# Altium schematic sheet HW1_Witt_u1090350.SchDoc
size A; SheetNumber: 1; SheetTotal: 1
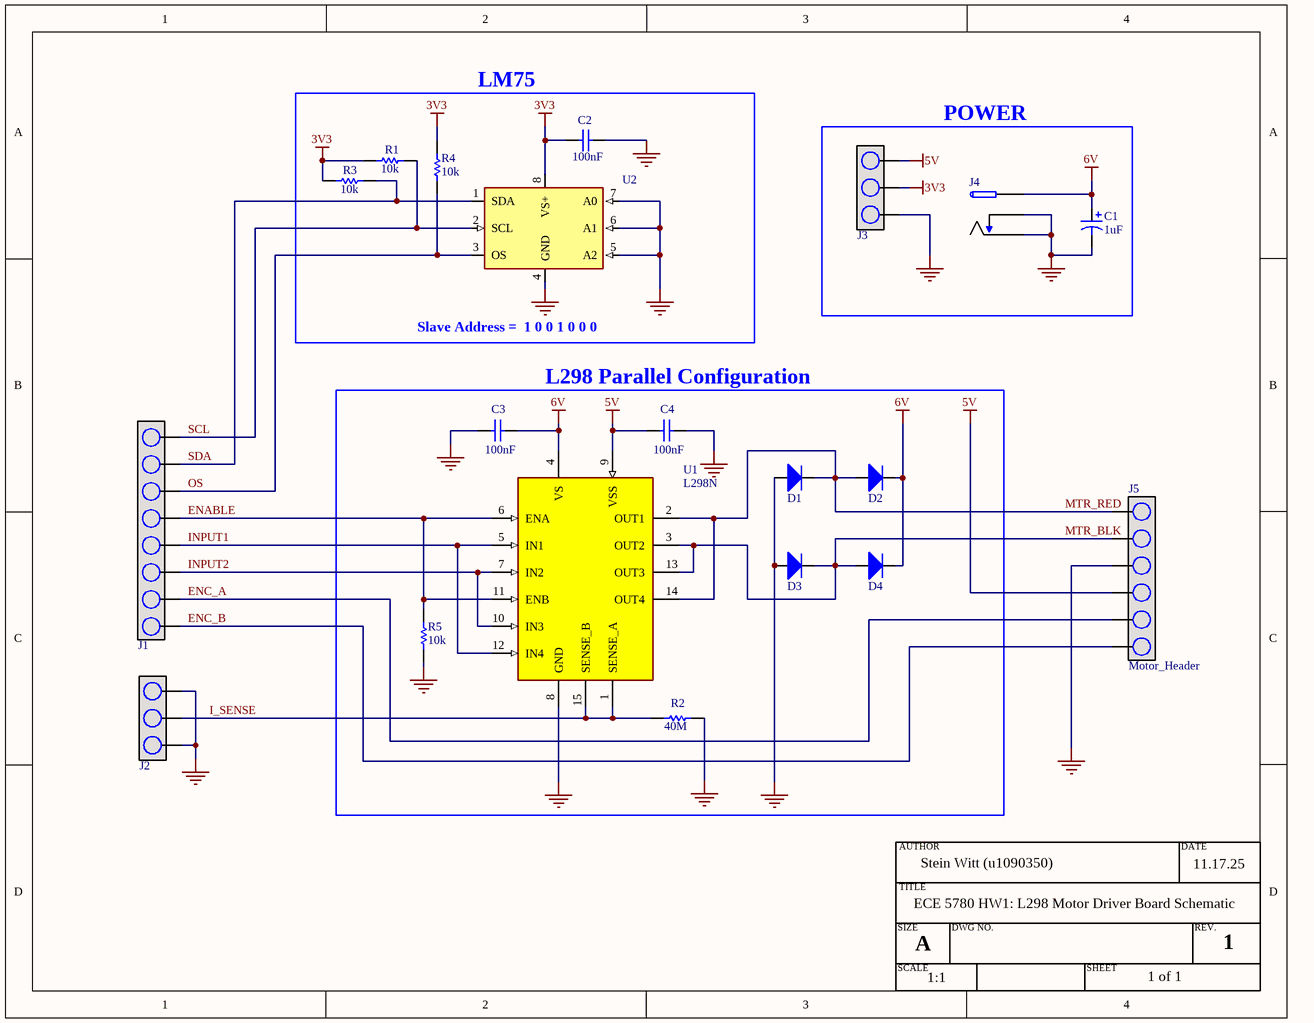
[diagram p0: HW1_Witt_u1090350.SchDoc]

## Parts
*  Title Block  (value not drawn)  (graphical)
C1  value 1uF  [CAP_TH_Radial_0511]  (hidden comment: REA010M2CBK-0511P)
C2  Capacitance: 100nF  [CAP_1206]  (hidden comment: C1206C104K5RAC7800)
C3  Capacitance: 100nF  [CAP_1206]  (hidden comment: C1206C104K5RAC7800)
C4  Capacitance: 100nF  [CAP_1206]  (hidden comment: C1206C104K5RAC7800)
D1  RS2AA R3G  [RS2AA]  (value not drawn)
D2  RS2AA R3G  [RS2AA]  (value not drawn)
D3  RS2AA R3G  [RS2AA]  (value not drawn)
D4  RS2AA R3G  [RS2AA]  (value not drawn)
J1  8 Pin Male Connector  [8 Pin THT Header]  (value not drawn)
J2  3 Pin 2.54mm Male Connector  [3 Pin THT Header]  (value not drawn)
J3  3 Pin 2.54mm Male Connector  [3 Pin THT Header]  (value not drawn)
J4  Barrel Jack  [GRAVITECH_CON-SOCJ-2155]  (value not drawn)
J5  Motor_Header  [6 Pin THT Header]
R1  value 10k  [RES_1206]  (hidden comment: RC1206JR-0710KL)
R2  value 40M  [RES_1206]  (hidden comment: RL1206FR-070R04L)
R3  value 10k  [RES_1206]  (hidden comment: RC1206JR-0710KL)
R4  value 10k  [RES_1206]  (hidden comment: RC1206JR-0710KL)
R5  value 10k  [RES_1206]  (hidden comment: RC1206JR-0710KL)
U1  L298N  [L298N]
U2  LM75AIMXNOPB  [SOIC8]  (value not drawn)

## Blocks framed on the sheet
LM75: C2 R1 R3 R4 U2
POWER: C1 J3 J4
L298 Parallel Configuration: C3 C4 D1-D4 R2 R5 U1

## Nets
3V3: C2.2 J3.2 R1.1 R3.1 R4.2 U2.8(VS+)
5V: C4.1 J3.3 J5.4 U1.9(VSS)
6V: C1.2(+) C3.2 D2.1(K) D4.1(K) J4.1(POS) U1.4(VS)
GND: C1.1(-) C2.1 C3.1 C4.2 D1.2(A) D3.2(A) J2.1 J2.3 J3.1 J4.2(NEG) J4.3(SW) J5.3 R2.1 R5.1 U1.8(GND) U2.4(GND) U2.5(A2) U2.6(A1) U2.7(A0)
ENABLE: J1.5 R5.2 U1.6(ENA) U1.11(ENB)
ENC_A: J1.2 J5.5
ENC_B: J1.1 J5.6
I_SENSE: J2.2 R2.2 U1.1(SENSE_A) U1.15(SENSE_B)
INPUT1: J1.4 U1.5(IN1) U1.12(IN4)
INPUT2: J1.3 U1.7(IN2) U1.10(IN3)
MTR_BLK: D3.1(K) D4.2(A) J5.2 U1.3(OUT2) U1.13(OUT3)
MTR_RED: D1.1(K) D2.2(A) J5.1 U1.2(OUT1) U1.14(OUT4)
OS: J1.6 R4.1 U2.3(OS)
SCL: J1.8 R1.2 U2.2(SCL)
SDA: J1.7 R3.2 U2.1(SDA)

## Notes on the sheet
- (near U2) Slave Address =  1 0 0 1 0 0 0
- ECE 5780 HW1: L298 Motor Driver Board Schematic
- Stein Witt (u1090350)
- 11.17.25
- (near *) A
- 1
- (near *) 1:1
- 1 of 1
- (in symbol Title Block) AUTHOR; DATE; TITLE; SIZE; DWG NO.; REV.; SCALE; SHEET

## Library data of the parts
C1 = REA010M2CBK-0511P: Radial Leaded 160V 1.0uF 20% 5x11mm; Manufacturer: Lelon; Dielectric Material: Aluminium; Polarity: Polarized; Ripple Current: 20mA; Supplier: Mouser; Supplier Part Number: 140-REA1R0M2CBK0511P; Manufacturer Part Number: REA010M2CBK-0511P; RoHS: Yes; Category: Aluminum Electrolytic Capacitors; Stock: 18847; Pricing: 1=0.1, 10=0.057, 50=0.057, 100=0.054, 500=0.047, 1000=0.041, 2000=0.034, 5000=0.028, 10000=0.023, 25000=0.02 (USD); Pins: 2; Min Operating Temperature: -40°C; Max Operating Temperature: 85°C; Capacitor Type: Aluminium; Tolerance  (fill in as +-): 20%; Package Style: RadialMeter; Packaging: Bulk; Tolerance (fill in as +-): 20%; Rated DC Voltage (URdc): 160V; Series: REA; Diameter: 5mm; Length: 11mm; Terminal Pitch: 2mm; Reach SVHC Compliant: Yes; RoHS Compliant: Yes; ComponentLink1URL: https://datasheet.ciiva.com:443/pdfs/VipMasterIC/IC/LELO/LELOS00009/LELOS00009-1.pdf?src-supplier=IHS+Markit; ComponentLink1Description: https://datasheet.ciiva.com:443/pdfs/VipMasterIC/IC/LELO/LELOS00009/LELOS00009-1.pdf?src-supplier=IHS+Markit; ComponentLink2URL: http://www.mouser.com/ds/2/231/lelon_REA[1]-341020.pdf?src-supplier=Mouser; ComponentLink2Description: http://www.mouser.com/ds/2/231/lelon_REA[1]-341020.pdf?src-supplier=Mouser
C2-C4 = C1206C104K5RAC7800: 0.1 µF ±10% 50V Ceramic Capacitor X7R 1206 (3216 Metric)
D1-D4 = RS2AA R3G: Diode Fast Recovery Rectifier 50V 1.5A 2-Pin DO-214AC Plastic T/R; Manufacturer: Taiwan Semiconductor; Supplier: Digikey; Supplier Part Number: RS2AAR3GCT-ND; Manufacturer Part Number: RS2AA R3G; RoHS: Yes; Stock: 3391; Pricing: 1=0.55, 10=0.365, 100=0.2482, 500=0.1944 (USD); RoHS Compliant: Yes; ComponentLink1URL: https://www.taiwansemi.com/products/datasheet/RS2AA%20SERIES_G14.pdf?src-supplier=Digikey; ComponentLink1Description: https://www.taiwansemi.com/products/datasheet/RS2AA%20SERIES_G14.pdf?src-supplier=Digikey
J5 = 6 pin 2.54mm Male Connector
R1 R3-R5 = RC1206JR-0710KL: Res Thick Film 1206 10K Ohm 5% 1/4W |100ppm/|C SMD Paper T/R; Manufacturer: Yageo; Temperature Coefficient: 100ppm/°C; Power Rating: 250mW; Voltage Rating: 200V; Supplier: Future Electronics; Supplier Part Number: 4750733; Manufacturer Part Number: RC1206JR-0710KL; RoHS: Yes; Category: Chip SMD Resistors; Stock: 4695000; Pricing: 5000=0.0032, 20000=0.003, 75000=0.0029, 150000=0.0028, 375000=0.0027 (USD); Case/Package: 1206; Case Code (Imperial): 1206; Case Code (Metric): 3216; Min Operating Temperature: -55°C; Max Operating Temperature: 155°C; Resistor Type: Thick Film; Tolerance: 5%; Packaging: Cut Tape; Package Quantity: 1; Termination: SMD/SMT; Number of Terminations: 2; Max Power Dissipation: 250mW; Series: RC1206; Resistance Tolerance: 5%; Length: 0.122inch; Width: 0.063inch; Height: 0.026inch; Lead Free: Lead Free; Reach SVHC Compliant: Unknown; RoHS Compliant: Yes; ComponentLink1URL: https://datasheet.ciiva.com/29154/402664-da-01-en-smd-widerstand-chip1206-10-kohm-29154546.pdf?src-supplier=Conrad; ComponentLink1Description: https://datasheet.ciiva.com/29154/402664-da-01-en-smd-widerstand-chip1206-10-kohm-29154546.pdf?src-supplier=Conrad; ComponentLink2URL: https://datasheet.ciiva.com/2458/pyu-rc1206-51-rohs-l-4-2458635.pdf?src-supplier=Digikey; ComponentLink2Description: https://datasheet.ciiva.com/2458/pyu-rc1206-51-rohs-l-4-2458635.pdf?src-supplier=Digikey; ComponentLink3URL: https://datasheet.ciiva.com/2458/pyu-rc1206-51-rohs-l-4-2458636.pdf?src-supplier=Digikey; ComponentLink3Description: https://datasheet.ciiva.com/2458/pyu-rc1206-51-rohs-l-4-2458636.pdf?src-supplier=Digikey; ComponentLink4URL: https://datasheet.ciiva.com/2458/pyu-rc1206-51-rohs-l-4-2458637.pdf?src-supplier=Digikey; ComponentLink4Description: https://datasheet.ciiva.com/2458/pyu-rc1206-51-rohs-l-4-2458637.pdf?src-supplier=Digikey; ComponentLink5URL: https://datasheet.ciiva.com/7983/444357-7983813.pdf?src-supplier=Element14; ComponentLink5Description: https://datasheet.ciiva.com/7983/444357-7983813.pdf?src-supplier=Element14
R2 = RL1206FR-070R04L: SMD Current Sense Resistor, 40 Milliohms, ± 1%, 250 mW, 1206 [3216 Metric], Thick Film; Manufacturer: Yageo; Power Rating: 250mW; Temperature Coefficient: 1200ppm/°C; Supplier: Digikey; Supplier Part Number: 311-.04LWCT-ND; Manufacturer Part Number: RL1206FR-070R04L; RoHS: Yes; Category: Chip SMD Resistors; Stock: 18033; Pricing: 1=0.52, 10=0.166, 50=0.1484, 100=0.1306, 1000=0.12757 (USD); Case/Package: 1206; Case Code (Imperial): 1206; Case Code (Metric): 3216; Weight: 0.000571oz; Min Operating Temperature: -55°C; Max Operating Temperature: 155°C; Tolerance: 1%; Packaging: Tape and Reel; Termination: SMD/SMT; Resistor Type: Thick Film; Package Quantity: 5000; Features: Moisture Resistant,Automotive AEC-Q200; Series: RL; Max Power Dissipation: 250mW; Number of Terminations: 2; Technology: THICK FILM; Length: 3.1mm; Width: 1.6mm; Height: 0.55mm; Ratings: AEC-Q200; Lead Free: Lead Free; RoHS Compliant: Yes; ComponentLink1URL: https://datasheet.ciiva.com/15328/pyu-rl-521-rohs-l-5-15328860.pdf?src-supplier=Mouser; ComponentLink1Description: https://datasheet.ciiva.com/15328/pyu-rl-521-rohs-l-5-15328860.pdf?src-supplier=Mouser
U1 = L298N: Dual Full Bridge Motor Driver 15-Pin(15+Tab) MULTIWATT V Tube; MP: L298N; Availability: Unavailable; Package: None; Value: *; Price: None
U2 = LM75AIMXNOPB: No Description Available; Mfr_Name: Texas Instruments; RefDes: RefDes; Type: Type